# Altium schematic sheet ecg_circuit.SchDoc: AD8232 ECG Circuit
size A; Revision: 1; SheetNumber: 3; SheetTotal: 4
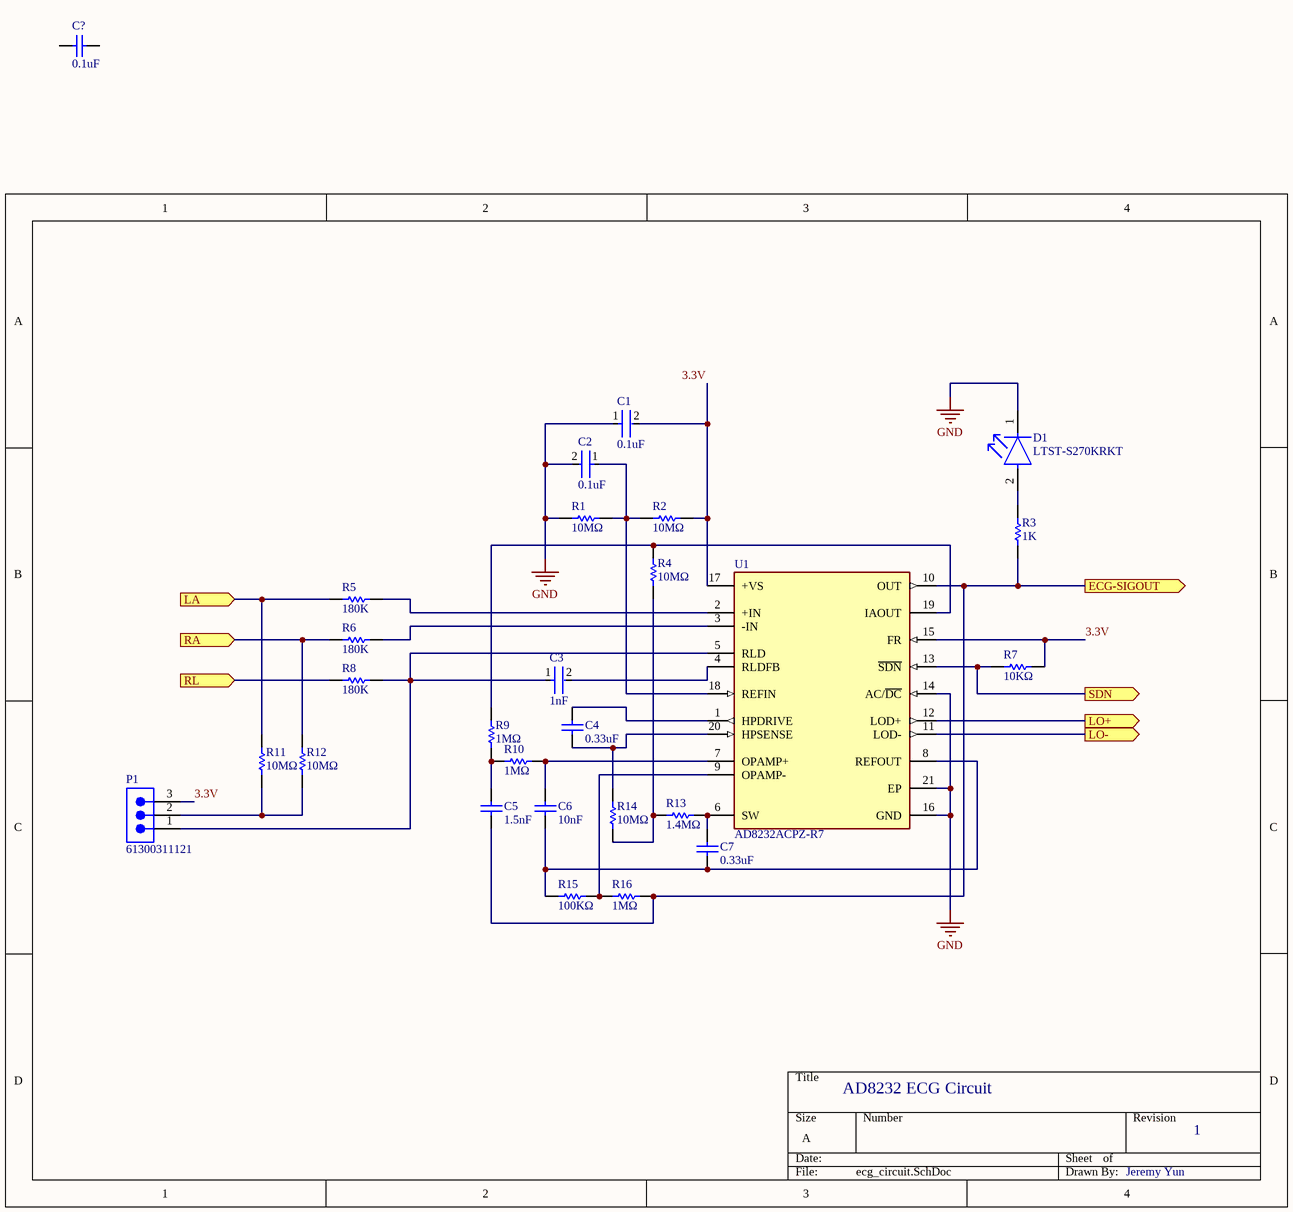
[diagram p0: ecg_circuit.SchDoc]

## Parts
C1  0.1uF  [FP-C0603C-CF-MFG]
C2  0.1uF  [FP-C0603C-CF-MFG]
C3  1nF  [FP-C1206C-EF-MFG]
C4  0.33uF  [CAPC1608X87X35ML15T15]
C5  1.5nF  [CAPC1206(3216)170_L]
C6  10nF  [CAPC2013X100X50NL20T25]
C7  0.33uF  [CAPC1608X87X35ML15T15]
C?  0.1uF  [FP-C0603C-CF-MFG]
D1  LTST-S270KRKT  [FP-LTST-S270KRKT-MFG]
P1  61300311121  [61300311121]
R1  10MΩ  [RESC1005X40X25ML05T10]
R2  10MΩ  [RESC1005X40X25ML05T10]
R3  1K  [FP-RC0402-0_4-IPC_A]
R4  10MΩ  [RESC1005X40X25ML05T10]
R5  180K  [FP-CR0402-IPC_A]
R6  180K  [FP-CR0402-IPC_A]
R7  10KΩ  [RESC1005X40X25LL05T10]
R8  180K  [FP-CR0402-IPC_A]
R9  1MΩ  [RESC1005X40X25NL05T10]
R10  1MΩ  [RESC1005X40X25NL05T10]
R11  10MΩ  [RESC1005X40X25ML05T10]
R12  10MΩ  [RESC1005X40X25ML05T10]
R13  1.4MΩ  [RESC1608X55X25ML10T15]
R14  10MΩ  [RESC1005X40X25ML05T10]
R15  100KΩ  [RESC1005X40X25NL05T10]
R16  1MΩ  [RESC1005X40X25NL05T10]
U1  AD8232ACPZ-R7  [FP-CP-20-8-IPC_C]

## Ports
ECG-SIGOUT (out), LA (in), LO+ (out), LO- (out), RA (in), RL (in), SDN (out)

## Nets
GND: C1.1 C2.2 D1.1(C) R1.1 U1.14(AC/~{DC}) U1.16(GND) U1.21(EP)
3.3V: C1.2 P1.3 R2.1 R7.2 U1.15(FR) U1.17(+VS)
ECG-SIGOUT: C5.1 R3.1 R16.2 U1.10(OUT) ; port ECG-SIGOUT
LA: R5.1 R11.2 ; port LA
LO+: U1.12(LOD+) ; port LO+
LO-: U1.11(LOD-) ; port LO-
RA: R6.1 R12.2 ; port RA
RL: R8.1 ; port RL
SDN: R7.1 U1.13(~{SDN}) ; port SDN
NetC2_1: C2.1 R1.2 R2.2 U1.18(REFIN)
NetC3_1: C3.1 P1.1 R8.2 U1.5(RLD)
NetC3_2: C3.2 U1.4(RLDFB)
NetC4_1: C4.1 R14.2 U1.20(HPSENSE)
NetC4_2: C4.2 U1.1(HPDRIVE)
NetC5_2: C5.2 R9.1 R10.1
NetC6_1: C6.1 C7.1 R15.2 U1.8(REFOUT)
NetC6_2: C6.2 R10.2 U1.7(OPAMP+)
NetC7_2: C7.2 R13.2 U1.6(SW)
NetD1_2: D1.2(A) R3.2
NetP1_2: P1.2 R11.1 R12.1
NetR4_1: R4.1 R13.1 R14.1
NetR4_2: R4.2 R9.2 U1.19(IAOUT)
NetR5_2: R5.2 U1.2(+IN)
NetR6_2: R6.2 U1.3(-IN)
NetR15_1: R15.1 R16.1 U1.9(OPAMP-)

Not connected (* = marked no-connect by the designer): C? 1 2

## Notes on the sheet
- Jeremy Yun

## Library data of the parts
C1 C2 C? = CMP-2006-03061-2: C0603C104K5RACTU; Manufacturer: KEMET; Tolerance: 0.1; Temperature Coefficient: 30ppm/°C; Material: Ceramic; Automotive Grade: Grade 1; Voltage Rating: 50 V; Value: 0.10 μF; Temperature Characteristic: X7R; Temperature: -55°C to +125°C; RoHS: TRUE; Temperature Range High: +125°C; Lead Free: Yes; Octopart: https://octopart.com/c0603c104k5ractu-kemet-139244; Digikey Description: CAP CER 0.1UF 50V X7R 0603; Category: Cap; Package: C0603C-CF; ComponentLink2Description: Datasheet; Temperature Range Low: -55°C; Device Class L1: Passive Components; Automotive: Yes; Device Class L3: Ceramic Capacitors; ComponentLink2URL: https://api.kemet.com/component-edge/download/datasheet/C0603C100J5GACAUTO.pdf; Capacitance: 0.10 μF; Device Class L2: Capacitors; Manufacturer Part Number: C0603C104K5RACTU; Height: 0.87mm
C3 = CMP-03020-034681-1: C1206C102KGRACTU; Voltage: 2kV; Tolerance: 10%; Dielectric: X7R; Dissipation Factor: 2.5%; Dielectric Material: Ceramic; Voltage Rating (DC): 2.5kV; REACH SVHC: No SVHC; Height: 1.6mm; Construction: Flat; Case/Package: 1206; Series: C; Mount: Surface Mount; RoHS Compliant: Yes; Package Quantity: 1; Length: 3.2mm; Width: 0.063inch; Voltage Rating: 2kV; Min Operating Temperature: -55°C; Case Code (Metric): 3216; Termination: SMD/SMT; Number of Pins: 2; Case Code (Imperial): 1206; Packaging: Tape and Reel; Thickness: 0.069inch; Depth: 1.6mm; Capacitance: 1nF; Radiation Hardening: No; Max Operating Temperature: 125°C
C4 C7 = CMP-2006-03188-1: Part Number: C0603C334Z3VACTU; Manufacturer: Kemet
C5 = CMP-1037-02645-1: 12062C152KAT2A Checked Ceramic Capacitor, Multilayer, Ceramic, 200V, 10% +Tol, 10% -Tol, X7R, 15% TC, 0.0015uF, Surface Mount, 1206 Ceramic Capacitors 0.0582; Case-EIA: 1206; Tolerance: Â±10%; Case-Metric: 3216; Value: 1.5nF; Max Thickness: 1.7 mm; Technology: SMT; Rated Voltage: 200 V
C6 = CMP-2007-03708-1: C0402C102K5RECAUTO; Part Number: C0805F103K5RACTU; Manufacturer: Kemet
D1 = CMP-2000-06630-2: LED RED CLEAR CHIP SMD R/A; Test Current: 20mA; Number of LEDs: 1; Power Rating: 75mW; Lens Style: Diffused; Luminous Intensity: 54mcd; Wavelength: 639nm; Dominant Wavelength: 631nm; Lens Color: Colorless; Forward Voltage: 2V; Viewing Angle: 130°; Forward Current: 30mA; Reverse Voltage: 5V; Illumination Color: Red; Case Code (Imperial): 0603; Color: Red; Packaging: Tape and Reel; Number of Pins: 2; Length: 1.6mm; Lens Transparency: Clear; Width: 1.15mm; Power Dissipation: 75mW; Lead Free: Lead Free; Max Power Dissipation: 75mW; Case/Package: 0603; Max Operating Temperature: 85°C; Mount: Surface Mount; Depth: 0.6mm; Number of Elements: 1; Radiation Hardening: No; Case Code (Metric): 1608; Package Quantity: 1; Height: 0.6mm; Min Operating Temperature: -55°C
P1 = CMP-1502-01062-2: NexarPartId: 32855521; Voltage Rating: 250V; Current Rating: 3A; Connector Type: Male Pin; Number of Positions: 3; Gender: Male; Contact Resistance: 20mΩ; Pitch: 2.54mm; Max Operating Temperature: 105°C; Lead Pitch: 2.54mm; Lead Free: Lead Free; Contact Mating Length: 5.9944mm; Contact Material: Copper; Number of Pins: 3; Orientation: Vertical; Height: 8.94mm; Packaging: Bulk; Min Operating Temperature: -40°C; Mount: Through Hole; RoHS: Compliant; Number of Contacts: 3; Operating Supply Voltage: 250V; Termination: Solder; Number of Rows: 1; Contact Plating: Gold; Color: Black; REACH SVHC: Unknown
R1 R2 R4 R11 R12 R14 = CMP-2002-07916-1: RC0402JR-0710ML; Manufacturer: Yageo / Phycomp; Part Number: RC0402JR-0710ML
R3 = CMP-2002-07472-3: RC0402FR-071KL RES 1K OHM 1% 1/16W 0402; Manufacturer: Yageo; Max Power Dissipation: 63mW; Resistance: 1kR; Voltage Rating (DC): 50V; Temperature Coefficient: 100ppm/°C; Power Rating: 62.5mW; Technology: THICK FILM; Size Code: 0402; Series: RC; Length: 1mm; Case/Package: 0402; Features: Moisture Resistant; Termination: SMD/SMT; Case Code (Metric): 1005; Reach SVHC Compliant: Yes; Number of Terminations: 2; Tolerance: 1%; Lead Free: Lead Free; Military Standard: Not; Resistor Type: Thick Film; Max Operating Temperature: 155°C; RoHS Compliant: Yes; Construction: Rectangular; Voltage Rating: 50V; Packaging: Tape and Reel; Height: 0.32mm; Number of Pins: 2; Resistance Tolerance: 1%; Case Code (Imperial): 0402; Depth: 0.5mm; Min Operating Temperature: -55°C; Width: 0.5mm; Manufacturer Part Number: RC0402FR-071KL
R5 R6 R8 = CMP-2002-04875-2: Thick Film Chip Resistors 0402 180kΩ 0.0625W 1% 100ppm/°C; Manufacturer: Bourns; Manufacturer Part Number: CR0402-FX-1803GLF; Power Rating: 62.5mW; Resistance: 180kR; Voltage Rating: 50V; Depth: 0.5mm; Tolerance: 1%; Width: 0.5mm; Package Quantity: 10000; Length: 1mm; Height: 0.35mm; Case/Package: 0402; Case Code (Metric): 1005; Thickness: 356um; Max Operating Temperature: 125°C; Termination: SMD/SMT; Packaging: Tape and Reel; Mount: Surface Mount; Military Standard: Not; Contact Plating: Tin; Case Code (Imperial): 0402; Temperature Coefficient: 100ppm/°C; Min Operating Temperature: -55°C; Radiation Hardening: No; Composition: Thick Film
R7 = CMP-2002-07353-1: RC0402FR-0710KL; Manufacturer: Yageo / Phycomp; Part Number: RC0402FR-0710KL
R9 R10 R16 = CMP-2002-07490-1: RC0402FR-071ML; Manufacturer: Yageo / Phycomp; Part Number: RC0402FR-071ML
R13 = CMP-1012-00864-2: RC0603FR-071M4L; Manufacturer: Yageo; Part Number: RC0603FR-071M4L
R15 = CMP-2002-07343-1: RC0402FR-07100KL; Manufacturer: Yageo / Phycomp; Part Number: RC0402FR-07100KL
U1 = CMP-09085-000003-1: IC ECG FRONT END 20LFCSP; Input Offset Voltage (Vos): 3mV; Power Supply Rejection Ratio (PSRR): 90dB; Input Bias Current: 50pA; Nominal Supply Current: 170uA; Min Supply Voltage: 2V; Common Mode Rejection Ratio: 80dB; Max Supply Voltage: 3.5V; Contact Plating: Tin; Operating Supply Current: 170uA; Packaging: Tape and Reel; REACH SVHC: No SVHC; Case/Package: LFCSP EP; Number of Pins: 20; Lead Free: Contains Lead; Min Operating Temperature: -40°C; Package Quantity: 1500; Mount: Surface Mount; Max Operating Temperature: 85°C